# EAGLE schematic board (EAGLE 6.5.0)
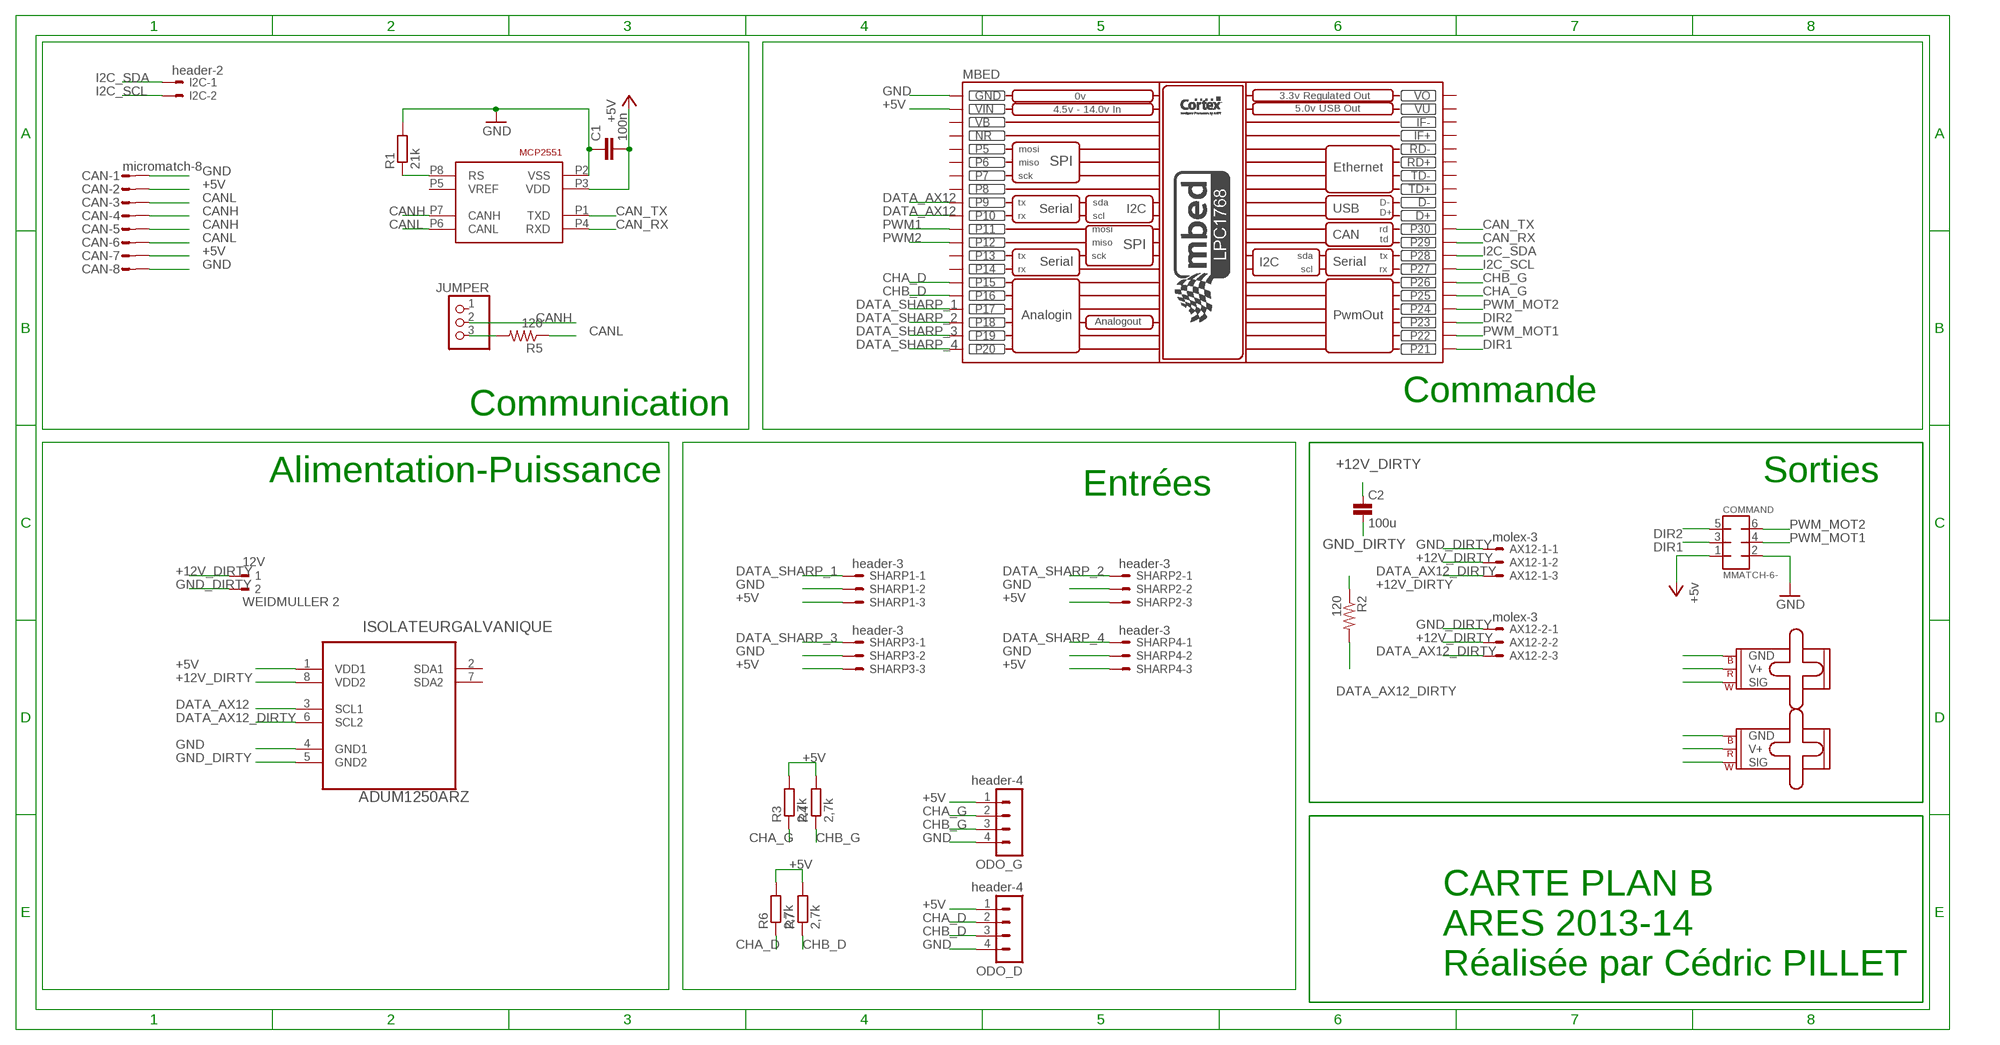
[diagram p0: schematic, sheet 1]

## Parts
12V  WEIDMULLER 2  90G-2  [90G-2]
AX12-1  molex-3  22-23-2031  [22-23-2031]
AX12-2  molex-3  22-23-2031  [22-23-2031]
C1  100n  C-EUC0805  [C0805]
C2  100u  C0805  [0805]
CAN  micromatch-8  MICROMATCH-8  [MICROMATCH-8]
COMMAND  MMATCH-6-  [AMP-215079-6]
I2C  header-2  22-23-2021  [22-23-2021]
ISOLATEURGALVANIQUE  ADUM1250ARZ  [SOIC127P600X175-8N]
JUMPER  PINHD-1X3  [1X03]
M1  SMALL_SERVO  [1X03]
M2  SMALL_SERVO  [1X03]
MBED  MBED_NXP_LPC1768  [MBED-KIT]
ODO_D  header-4  MA04-1  [MA04-1]
ODO_G  header-4  MA04-1  [MA04-1]
R1  21k  R-EU_R0805  [R0805]
R2  120  R-US_M0805  [M0805]
R3  2,7k  R-EU_R0805  [R0805]
R4  2,7k  R-EU_R0805  [R0805]
R5  120  R-US_M0805  [M0805]
R6  2,7k  R-EU_R0805  [R0805]
R7  2,7k  R-EU_R0805  [R0805]
SHARP1  header-3  22-23-2031  [22-23-2031]
SHARP2  header-3  22-23-2031  [22-23-2031]
SHARP3  header-3  22-23-2031  [22-23-2031]
SHARP4  header-3  22-23-2031  [22-23-2031]
TRANSCEIVER  MCP2551  [SOIC_8]

## Nets
+5V: C1.2 CAN.2 CAN.7 COMMAND.1 ISOLATEURGALVANIQUE.1(VDD1) M1.2(V+) M2.2(V+) MBED.VIN ODO_D.1 ODO_G.1 R3.2 R4.2 R6.2 R7.2 SHARP1.3 SHARP2.3 SHARP3.3 SHARP4.3 TRANSCEIVER.P3(VDD) ; supply symbol labelled +5v
+12V_DIRTY: 12V.1 AX12-1.2 AX12-2.2 C2.1 ISOLATEURGALVANIQUE.8(VDD2) R2.1
CAN_RX: MBED.P$29(P29) TRANSCEIVER.P4(RXD)
CAN_TX: MBED.P$30(P30) TRANSCEIVER.P1(TXD)
CANH: CAN.4 CAN.5 JUMPER.2 TRANSCEIVER.P7(CANH)
CANL: CAN.3 CAN.6 R5.1 TRANSCEIVER.P6(CANL)
CHA_D: MBED.P$15(P15) ODO_D.2 R6.1
CHA_G: MBED.P$25(P25) ODO_G.2 R3.1
CHB_D: MBED.P$16(P16) ODO_D.3 R7.1
CHB_G: MBED.P$26(P26) ODO_G.3 R4.1
DATA_AX12: ISOLATEURGALVANIQUE.3(SCL1) MBED.P$9(P9) MBED.P$10(P10)
DATA_AX12_DIRTY: AX12-1.3 AX12-2.3 ISOLATEURGALVANIQUE.6(SCL2) R2.2
DATA_SHARP_1: MBED.P$17(P17) SHARP1.1
DATA_SHARP_2: MBED.P$18(P18) SHARP2.1
DATA_SHARP_3: MBED.P$19(P19) SHARP3.1
DATA_SHARP_4: MBED.P$20(P20) SHARP4.1
DIR1: COMMAND.3 MBED.P$21(P21)
DIR2: COMMAND.5 MBED.P$23(P23)
GND: C1.1 CAN.1 CAN.8 COMMAND.2 ISOLATEURGALVANIQUE.4(GND1) M1.3(GND) M2.3(GND) MBED.GND ODO_D.4 ODO_G.4 R1.2 SHARP1.2 SHARP2.2 SHARP3.2 SHARP4.2 TRANSCEIVER.P2(VSS)
GND_DIRTY: 12V.2 AX12-1.1 AX12-2.1 C2.2 ISOLATEURGALVANIQUE.5(GND2)
I2C_SCL: I2C.2 MBED.P$27(P27)
I2C_SDA: I2C.1 MBED.P$28(P28)
N$1: R1.1 TRANSCEIVER.P8(RS)
N$9: JUMPER.3 R5.2
PWM1: M1.1(SIG) MBED.P$11(P11)
PWM2: M2.1(SIG) MBED.P$12(P12)
PWM_MOT1: COMMAND.4 MBED.P$22(P22)
PWM_MOT2: COMMAND.6 MBED.P$24(P24)
Unconnected: ISOLATEURGALVANIQUE.2(SDA1) ISOLATEURGALVANIQUE.7(SDA2) JUMPER.1 MBED.D+ MBED.D- MBED.IF+ MBED.IF- MBED.P$5(P5) MBED.P$6(P6) MBED.P$7(P7) MBED.P$8(P8) MBED.P$13(P13) MBED.P$14(P14) MBED.RD+ MBED.RD- MBED.TD+ MBED.TD- TRANSCEIVER.P5(VREF)

## Notes on the sheet
- Commande
- Communication
- Alimentation-Puissance | Sorties
- Entrées
- CARTE PLAN B
  ARES 2013-14
  Réalisée par Cédric PILLET

## Power pins joined to a net without a drawn wire
NR: MBED.NR
VB: MBED.VB
VO: MBED.VOUT(VO)
VU: MBED.VU

## Library data of the parts
12V = con-weidmueller-sl35:90G-2: WEIDMUELLER CLAMP CONNECTOR; OC_FARNELL: unknown; OC_NEWARK: unknown
AX12-1 AX12-2 SHARP1-SHARP4 = con-molex:22-23-2031: .100" (2.54mm) Center Header - 3 Pin; MF: MOLEX; MPN: 22-23-2031; OC_FARNELL: 1462950; OC_NEWARK: 30C0862
C1 = rcl:C-EU: CAPACITOR, European symbol
C2 = mbed-rlcq:C
CAN = con-amp-micromatch:MICROMATCH-8: MicroMaTch 8 7-215464-8 / 0-215464-8 Drawing Number C-215464 DDEController.pdf; MF: FARNELL; MPN: 7-215464-8; OC_FARNELL: 3784642; OC_NEWARK: 26H0301
COMMAND = jt-con-micromatch:MMATCH-6-*
I2C = con-molex:22-23-2021: .100" (2.54mm) Center Header - 2 Pin; MF: MOLEX; MPN: 22-23-2021; OC_FARNELL: 1462926; OC_NEWARK: 25C3832
ISOLATEURGALVANIQUE = Analog Devices_By_element14_Batch_1:ADUM1250ARZ: Hot Swappable, Dual I2C Isolators; MPN: ADUM1250ARZ; OC_FARNELL: 1814353; OC_NEWARK: 27M9880; PACKAGE: SOIC-8; SUPPLIER: Analog Devices
JUMPER = pinhead:PINHD-1X3: PIN HEADER
M1 M2 = SparkFun-Electromechanical:SMALL_SERVO: Small servo motor This is the small servo used in the SIK. SKU: ROB-09065
MBED = MBED_v2.1:MBED_NXP_LPC1768: Mbed LPC1768 - ARM CORTEX v2.1 * Schematic symbol is now placed in eagles's default raster. *The pads diameter are suitable for routing between mbed pins * mbed pads are 0.8 mm drill diameter. --------------------------------------------- Created by: Mohamed Yousry *Alexandria, Egypt *Email: mohamed.yousry@ieeegoldegypt.org
ODO_D ODO_G = con-lstb:MA04-1: PIN HEADER; OC_FARNELL: unknown; OC_NEWARK: unknown
R1 R3 R4 R6 R7 = rcl:R-EU_: RESISTOR, European symbol
R2 R5 = rcl:R-US_: RESISTOR, American symbol
TRANSCEIVER = microchip:MCP2551

## Net classes
1 +5V: width 0.6 mm, drill 0.2 mm, clearance 0.4 mm